# EAGLE schematic linearSensor (EAGLE 7.3.0)
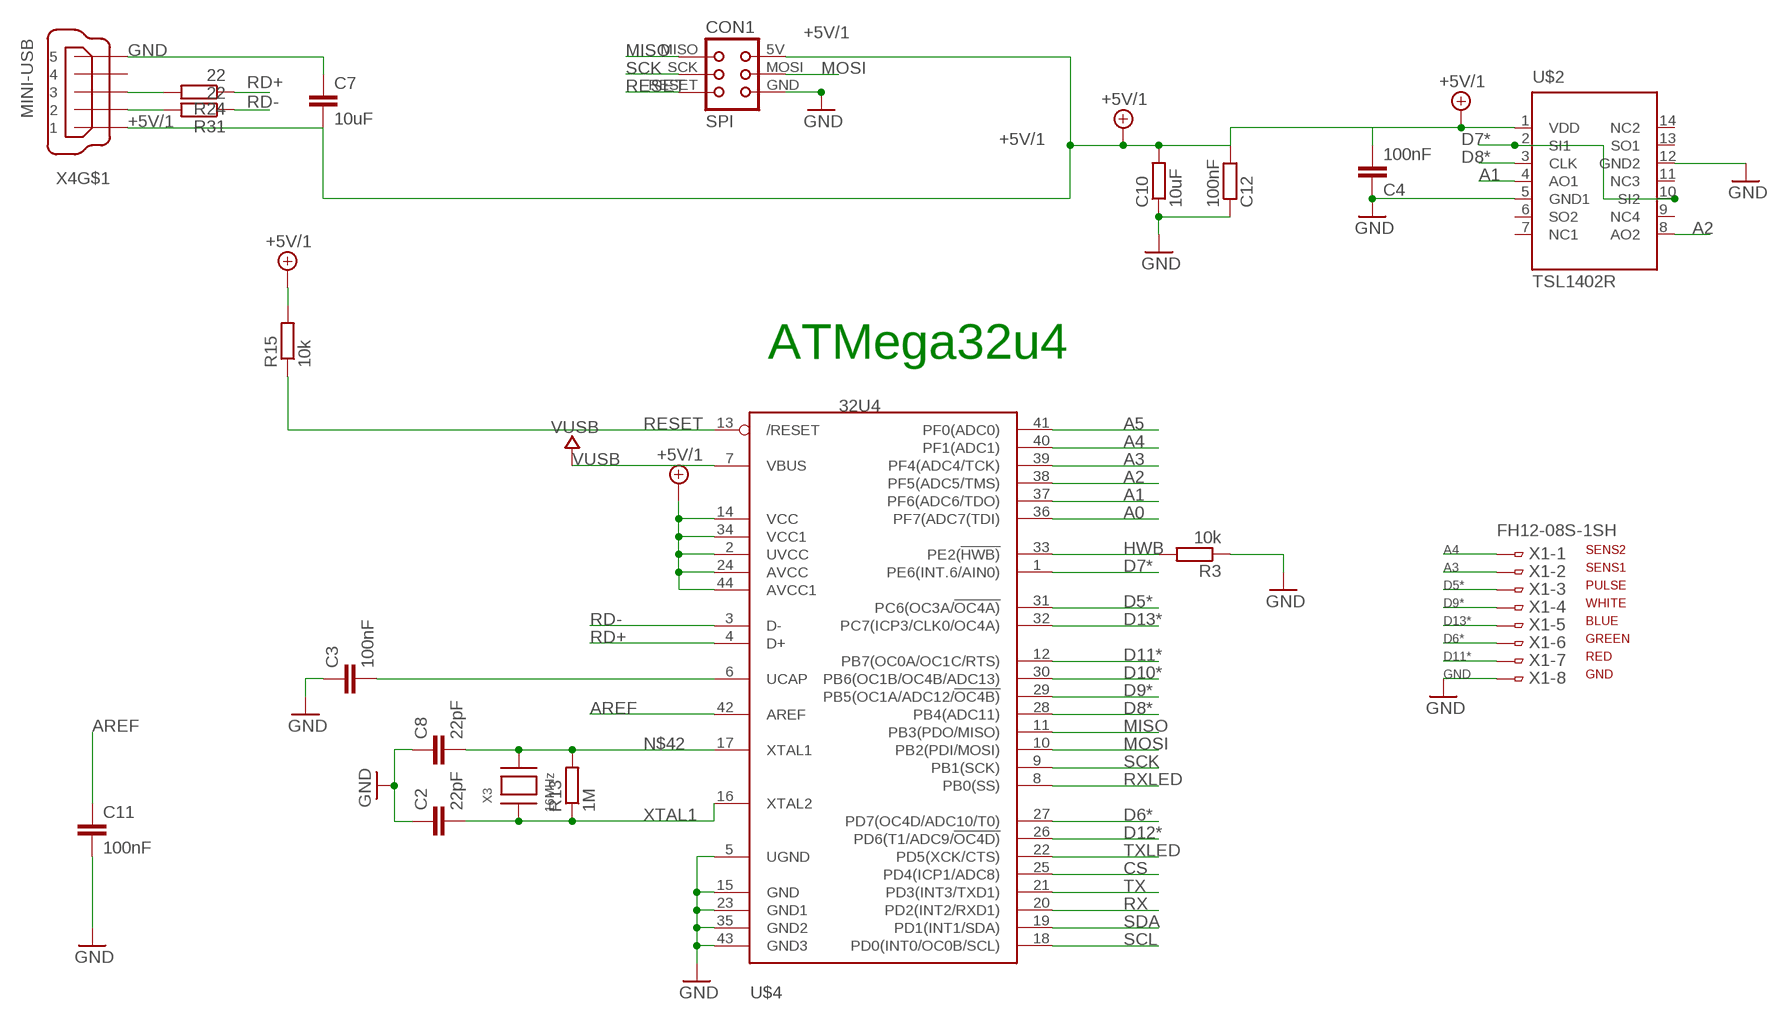
[diagram p0: schematic, sheet 1]

## Parts
C2  22pF  C-EUC0805K  [C0805K]
C3  100nF  C-EUC0805K  [C0805K]
C4  100nF  C-EUC0805  [C0805]
C7  10uF  C-EUC0805  [C0805]
C8  22pF  C-EUC0805K  [C0805K]
C10  10uF  R-EU_M0805  [M0805]
C11  100nF  C-EUC0805K  [C0805K]
C12  100nF  R-EU_M0805  [M0805]
CON1  SPI  TINYISPT  [TC2030-MCP-NL]
R3  10k  R-EU_M0805  [M0805]
R13  1M  R-EU_M0805  [M0805]
R15  10k  R-EU_M0805  [M0805]
R24  22  R-EU_M0805  [M0805]
R31  22  R-EU_M0805  [M0805]
U$2  TSL1402R  [DIL14]
U$4  32U4  ATMEGA32U4-AU  [TQFP44]
X1  FH12-08S-1SH  [FH12-08S-1SH]
X3  16MHz  XTALNX6035  [NX6035]
X4  MINI-USB  MINI-USB-SCHIELD-32005-201  [32005-201]

## Nets
+5V/1 [fine]: C4.2 C7.2 C10.2 C12.2 CON1.5V(VCC) R15.2 U$2.1(VDD) U$4.2(UVCC) U$4.14(VCC) U$4.24(AVCC) U$4.34(VCC1) U$4.44(AVCC1) X4.1
A0: U$4.36(PF7(ADC7(TDI))
A1: U$2.4(AO1) U$4.37(PF6(ADC6/TDO))
A2: U$2.8(AO2) U$4.38(PF5(ADC5/TMS))
A3: U$4.39(PF4(ADC4/TCK)) X1.2
A4: U$4.40(PF1(ADC1)) X1.1
A5: U$4.41(PF0(ADC0))
AREF: C11.1 U$4.42(AREF)
CS: U$4.25(PD4(ICP1/ADC8))
D5*: U$4.31(PC6(OC3A/!OC4A)) X1.3
D6*: U$4.27(PD7(OC4D/ADC10/T0)) X1.6
D7*: U$2.2(SI1) U$2.10(SI2) U$4.1(PE6(INT.6/AIN0))
D8*: U$2.3(CLK) U$4.28(PB4(ADC11))
D9*: U$4.29(PB5(OC1A/ADC12/!OC4B)) X1.4
D10*: U$4.30(PB6(OC1B/OC4B/ADC13))
D11*: U$4.12(PB7(OC0A/OC1C/RTS)) X1.7
D12*: U$4.26(PD6(T1/ADC9/!OC4D))
D13*: U$4.32(PC7(ICP3/CLK0/OC4A)) X1.5
D+USB: R24.2 X4.3
D-USB: R31.2 X4.2
GND [power]: C2.1 C3.1 C4.1 C7.1 C8.1 C10.1 C11.2 C12.1 CON1.GND R3.1 U$2.5(GND1) U$2.12(GND2) U$4.5(UGND) U$4.15(GND) U$4.23(GND1) U$4.35(GND2) U$4.43(GND3) X1.8 X4.5
HWB: R3.2 U$4.33(PE2(!HWB))
MISO: CON1.MISO U$4.11(PB3(PDO/MISO))
MOSI: CON1.MOSI U$4.10(PB2(PDI/MOSI))
N$16: C3.2 U$4.6(UCAP)
N$42: C8.2 R13.2 U$4.17(XTAL1) X3.P$2
RD+: R24.1 U$4.4(D+)
RD-: R31.1 U$4.3(D-)
RESET: CON1.RESET R15.1 U$4.13(/RESET)
RX: U$4.20(PD2(INT2/RXD1))
RXLED: U$4.8(PB0(SS))
SCK: CON1.SCK U$4.9(PB1(SCK))
SCL: U$4.18(PD0(INT0/OC0B/SCL))
SDA: U$4.19(PD1(INT1/SDA))
TX: U$4.21(PD3(INT3/TXD1))
TXLED: U$4.22(PD5(XCK/CTS))
VUSB: U$4.7(VBUS)
XTAL1: C2.2 R13.1 U$4.16(XTAL2) X3.P$1
Unconnected: U$2.6(SO2) U$2.7(NC1) U$2.9(NC4) U$2.11(NC3) U$2.13(SO1) U$2.14(NC2) X4.4 X4.M1(S:S1) X4.M2(S:S2) X4.M3(S:S3) X4.M4(S:S4)

## Notes on the sheet
- ATMega32u4
- SENS2
- SENS1
- PULSE
- WHITE
- BLUE
- GREEN
- RED
- GND

## Library data of the parts
C2-C4 C7 C8 C11 = rcl:C-EU: CAPACITOR, European symbol
C10 C12 R13 R24 R31 = rcl:R-EU_: RESISTOR, European symbol
CON1 = lpatiny:TINYISP: CONNECTOR
R3 R15 = resistor:R-EU_: RESISTOR, European symbol
U$2 = lpatiny:TSL1402R
U$4 = adafruit:ATMEGA32U4: http://www.ladyada.net/library/eagle
X1 = con-hirose:FH12-08S-1S: 1mm Pitch Connectors For FPC/FFC Source: Data sheet <http://www.hirose.co.jp/cataloge_hp/e58605370.pdf>; OC_FARNELL: unknown; OC_NEWARK: unknown
X3 = lpatiny:XTAL: Low cost SMT crystals, no capacitors included http://www.ladyada.net/library/eagle
X4 = con-cypressindustries:MINI-USB-SCHIELD-: MINI USB-B Conector Source: www.cypressindustries.com; OC_FARNELL: unknown; OC_NEWARK: unknown

## Net classes
0 default: width 0.305 mm
1 power: width 0.457 mm
2 VIN: width 0.457 mm
3 fine: width 0.305 mm
4 aref: width 0.305 mm